# Altium schematic sheet weller.SchDoc: Weller RT controller analog
size A3; DrawnBy: Grzegorz Gajoch; Address1: Grzegorz Gajoch; Address2: grzegorz@gajoch.pl; Revision: 1
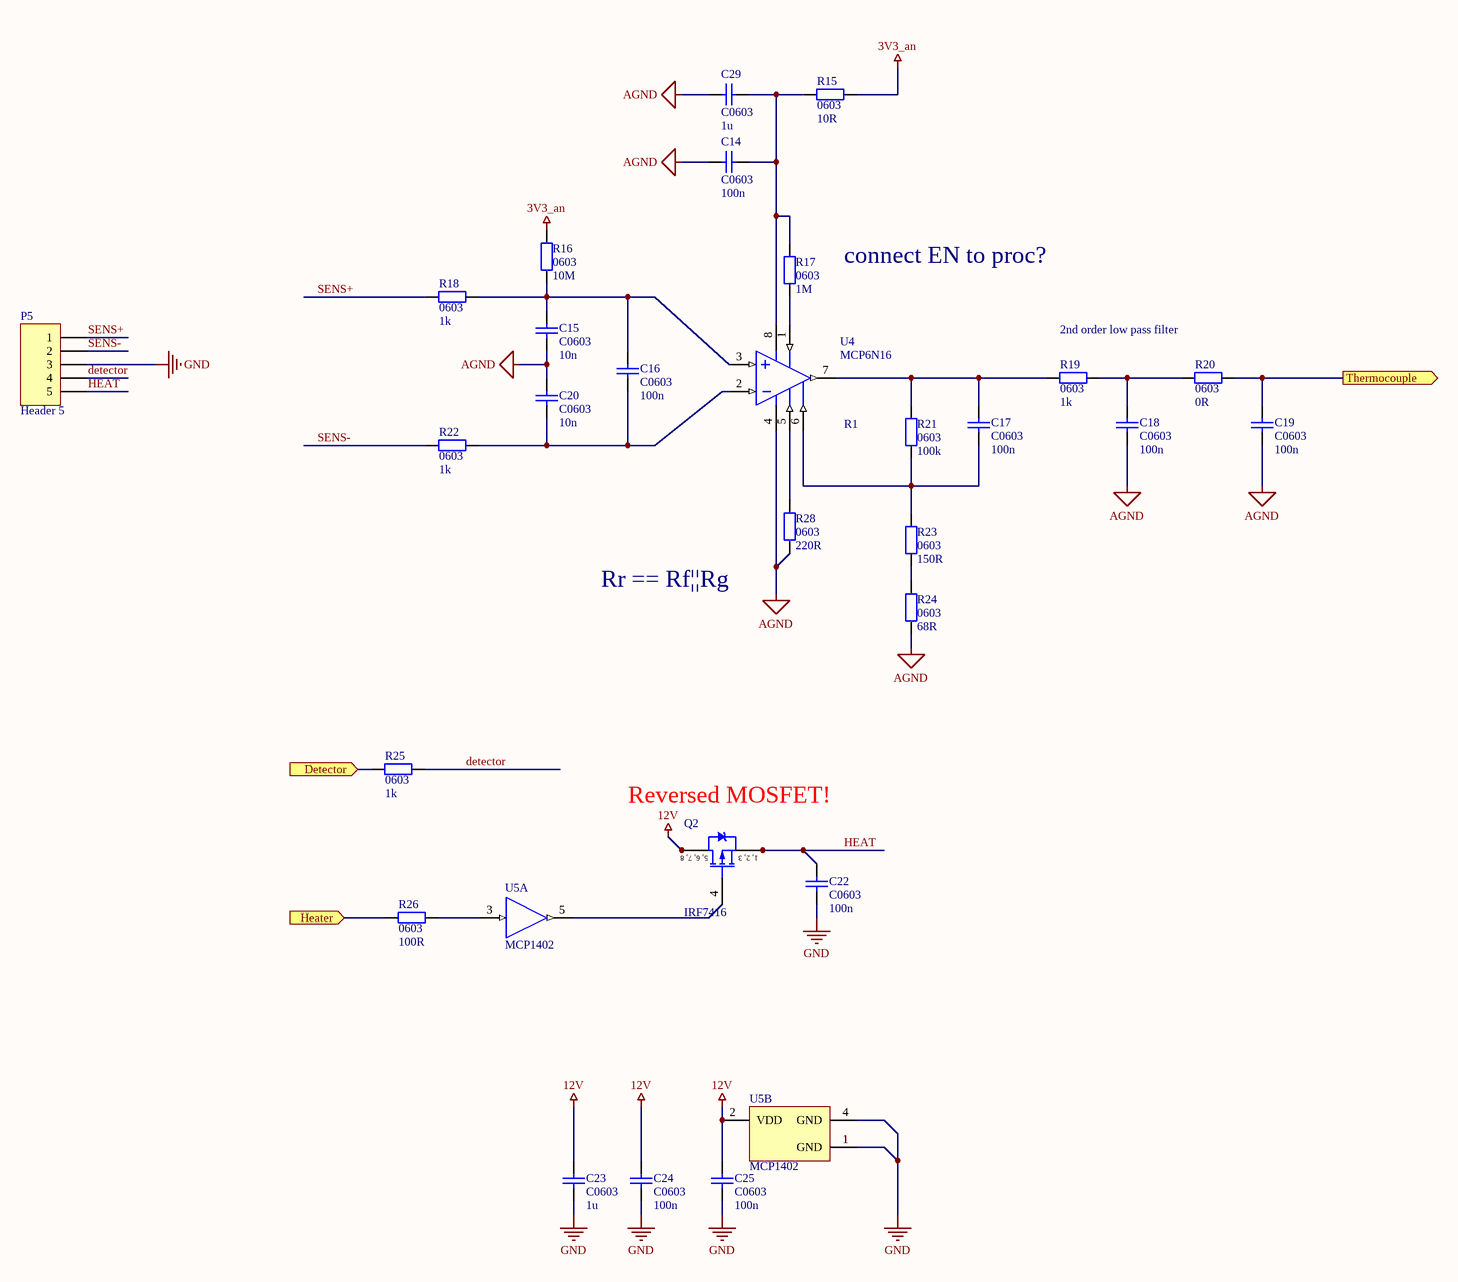
[diagram p0: weller.SchDoc]

## Parts
C14  100n  [C0603]
C15  10n  [C0603]
C16  100n  [C0603]
C17  100n  [C0603]
C18  100n  [C0603]
C19  100n  [C0603]
C20  10n  [C0603]
C22  100n  [C0603]
C23  1u  [C0603]
C24  100n  [C0603]
C25  100n  [C0603]
C29  1u  [C0603]
P5  Header 5  [HDR1X5]
Q2  IRF7416  [SOIC-8_M]
R15  10R  [0603]
R16  10M  [0603]
R17  1M  [0603]
R18  1k  [0603]
R19  1k  [0603]
R20  0R  [0603]
R21  100k  [0603]
R22  1k  [0603]
R23  150R  [0603]
R24  68R  [0603]
R25  1k  [0603]
R26  100R  [0603]
R28  220R  [0603]
U4  MCP6N16  [MSOP-MS8_M]
U5  MCP1402  [SOT23-5_M]  (parts A,B of 2)

## Ports
Detector (in), Heater (in), Thermocouple (out)

## Nets
3V3_an: R15.1 R16.1
12V: C23.1 C24.1 C25.1 Q2.5(D) Q2.6(D) Q2.7(D) Q2.8(D) U5.2(VDD)
AGND: C14.1 C15.1 C18.2 C19.2 C20.1 C29.2 R24.2 R28.2 U4.4(VSS)
GND: C22.2 C23.2 C24.2 C25.2 P5.3 U5.1(GND) U5.4(GND)
detector: P5.4 R25.2
Detector: R25.1 ; port Detector  [a separate net that carries the same name]
HEAT: C22.1 P5.5 Q2.1(S) Q2.2(S) Q2.3(S)
Heater: R26.1 ; port Heater
SENS+: P5.1 R18.1
SENS-: P5.2 R22.1
Thermocouple: C19.1 R20.2 ; port Thermocouple
NetC14_2: C14.2 C29.1 R15.2 R17.1 U4.8(VDD)
NetC15_2: C15.2 C16.1 R16.2 R18.2 U4.3(VIN+)
NetC16_2: C16.2 C20.2 R22.2 U4.2(VIN-)
NetC17_1: C17.1 R19.1 R21.1 U4.7(VOUT)
NetC17_2: C17.2 R21.2 R23.1 U4.6(FB)
NetC18_1: C18.1 R19.2 R20.1
NetQ2_4: Q2.4(G) U5.5(OUT)
NetR17_2: R17.2 U4.1(EN)
NetR23_2: R23.2 R24.1
NetR26_2: R26.2 U5.3(IN)
NetR28_1: R28.1 U4.5(Vref)

## Notes on the sheet
- connect EN to proc?
- 2nd order low pass filter
- R1
- (near R28) Rr == Rf||Rg
- (near Q2) Reversed MOSFET!
- Title
- Size:
- Date:
- A3
- Number:
- Time:
- Revision:
- Sheet
- of
- File:
- (in symbol IRF7416) 5, 6, 7, 8; 1, 2, 3

## Library data of the parts
C14-C20 C22-C25 C29 = Cap: Generic capacitor; Packge: C0603
  C14 C16-C19 C22 C24 C25: Value: 100n
  C15 C20: Value: 10n
  C23 C29: Value: 1u
P5 = Header 5: Header, 5-Pin; LatestRevisionDate: 17-Jul-2002; LatestRevisionNote: Re-released for DXP Platform.; Publisher: Altium Limited
Q2 = IRF7416: Power P-MOSFET; Published: 8-Jun-2000; LatestRevisionDate: 13-Apr-2006; LatestRevisionNote: IPC-7351 Footprint Added.; DatasheetVersion: Aug-1997; PackageVersion: Feb-2001; PackageReference: SO-8; Publisher: Altium Limited; PackageDescription: 8-Pin Plastic Small Outline Integrated Circuit 1.27 mm Pitch; Code_JEDEC: MS-012-AA; Code_IPC: SOIC127P600-8; ComponentLink1Description: Manufacturer Link; ComponentLink1URL: http://www.irf.com/; ComponentLink2Description: Datasheet; ComponentLink2URL: http://www.irf.com/product-info/datasheets/data/irf7416.pdf
R15-R26 R28 = Res: Generic resistor; Package: 0603
  R15: Value: 10R
  R16: Value: 10M
  R17: Value: 1M
  R18 R19 R22 R25: Value: 1k
  R20: Value: 0R
  R21: Value: 100k
  R23: Value: 150R
  R24: Value: 68R
  R26: Value: 100R
  R28: Value: 220R
U5 = MCP1402: MCP1402 MOSFET driver
U4 = MCP6N16: ComponentLink1URL: http://ww1.microchip.com/downloads/en/DeviceDoc/20005318A.pdf; ComponentLink1Description: Datasheet